# Altium schematic sheet FMC_Test_Module.SchDoc: FMC Test Module
size A3; Author: mayerph; DrawnBy: mayerph; Organization: IIS; Revision: PA; SheetNumber: 3; SheetTotal: 3
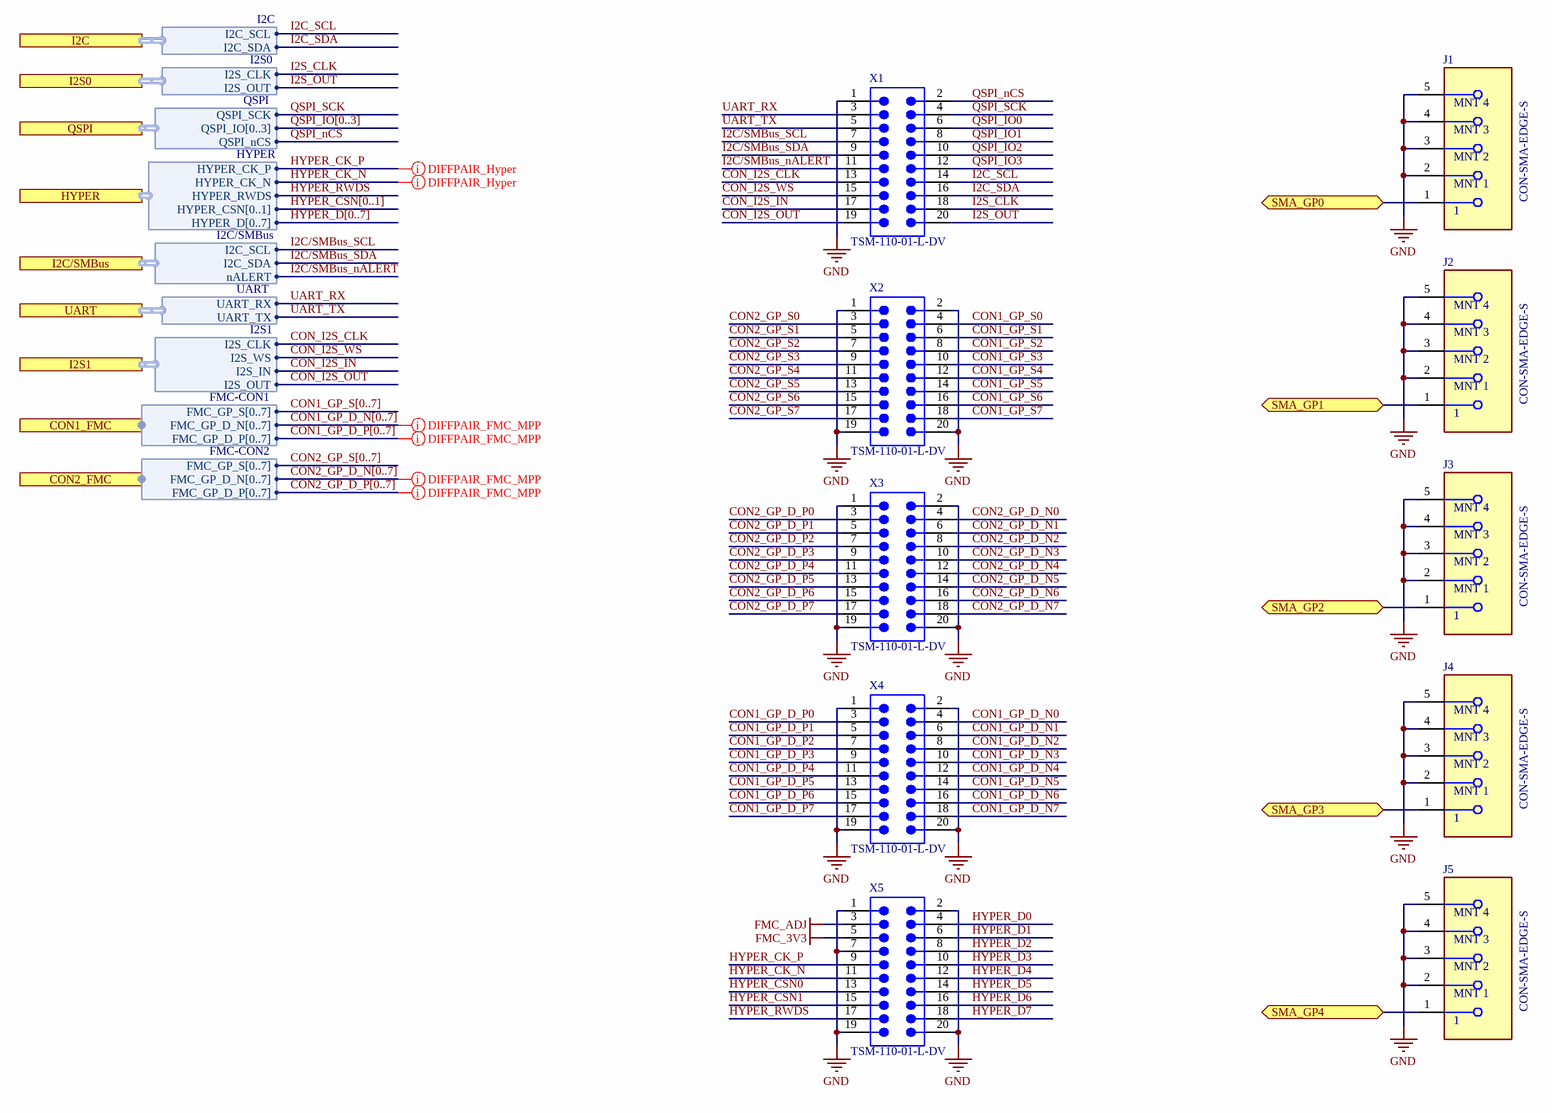
[diagram p0: FMC_Test_Module.SchDoc]

## Parts
J1  CON-SMA-EDGE-S  [FP-CON-SMA-EDGE-S-MFG]
J2  CON-SMA-EDGE-S  [FP-CON-SMA-EDGE-S-MFG]
J3  CON-SMA-EDGE-S  [FP-CON-SMA-EDGE-S-MFG]
J4  CON-SMA-EDGE-S  [FP-CON-SMA-EDGE-S-MFG]
J5  CON-SMA-EDGE-S  [FP-CON-SMA-EDGE-S-MFG]
X1  TSM-110-01-L-DV  [SMTC-TSM-110-01-X-DV]
X2  TSM-110-01-L-DV  [SMTC-TSM-110-01-X-DV]
X3  TSM-110-01-L-DV  [SMTC-TSM-110-01-X-DV]
X4  TSM-110-01-L-DV  [SMTC-TSM-110-01-X-DV]
X5  TSM-110-01-L-DV  [SMTC-TSM-110-01-X-DV]

## Ports
CON1_FMC (harness FMC-CON1), CON2_FMC (harness FMC-CON2), HYPER (harness HYPER), I2C (harness I2C), I2C/SMBus (harness I2C/SMBus), I2S0 (harness I2S0), I2S1 (harness I2S1), QSPI (harness QSPI), SMA_GP0 (bidir), SMA_GP1 (bidir), SMA_GP2 (bidir), SMA_GP3 (bidir), SMA_GP4 (bidir), UART (harness UART)

## Harnesses
I2C/SMBus: I2C_SDA, I2C_SCL, nALERT
UART: UART_TX, UART_RX
I2S1: I2S_OUT, I2S_IN, I2S_WS, I2S_CLK
FMC-CON1: FMC_GP_D_N[0..7], FMC_GP_S[0..7], FMC_GP_D_P[0..7]
I2S0: I2S_OUT, I2S_CLK
I2C: I2C_SDA, I2C_SCL
QSPI: QSPI_SCK, QSPI_IO[0..3], QSPI_nCS
HYPER: HYPER_CK_N, HYPER_CK_P, HYPER_RWDS, HYPER_CSN[0..1], HYPER_D[0..7]
FMC-CON2: FMC_GP_D_N[0..7], FMC_GP_S[0..7], FMC_GP_D_P[0..7]

## Nets
FMC_3V3: X5.5
FMC_ADJ: X5.3
GND: J1.2(MNT_1) J1.3(MNT_2) J1.4(MNT_3) J1.5(MNT_4) J2.2(MNT_1) J2.3(MNT_2) J2.4(MNT_3) J2.5(MNT_4) J3.2(MNT_1) J3.3(MNT_2) J3.4(MNT_3) J3.5(MNT_4) J4.2(MNT_1) J4.3(MNT_2) J4.4(MNT_3) J4.5(MNT_4) J5.2(MNT_1) J5.3(MNT_2) J5.4(MNT_3) J5.5(MNT_4) X1.1 X2.1 X2.2 X2.19 X2.20 X3.1 X3.2 X3.19 X3.20 X4.1 X4.2 X4.19 X4.20 X5.1 X5.2 X5.7 X5.19 X5.20
CON1_GP_D_N0: X4.4
CON1_GP_D_N1: X4.6
CON1_GP_D_N2: X4.8
CON1_GP_D_N3: X4.10
CON1_GP_D_N4: X4.12
CON1_GP_D_N5: X4.14
CON1_GP_D_N6: X4.16
CON1_GP_D_N7: X4.18
CON1_GP_D_P0: X4.3
CON1_GP_D_P1: X4.5
CON1_GP_D_P2: X4.7
CON1_GP_D_P3: X4.9
CON1_GP_D_P4: X4.11
CON1_GP_D_P5: X4.13
CON1_GP_D_P6: X4.15
CON1_GP_D_P7: X4.17
CON1_GP_S0: X2.4
CON1_GP_S1: X2.6
CON1_GP_S2: X2.8
CON1_GP_S3: X2.10
CON1_GP_S4: X2.12
CON1_GP_S5: X2.14
CON1_GP_S6: X2.16
CON1_GP_S7: X2.18
CON2_GP_D_N0: X3.4
CON2_GP_D_N1: X3.6
CON2_GP_D_N2: X3.8
CON2_GP_D_N3: X3.10
CON2_GP_D_N4: X3.12
CON2_GP_D_N5: X3.14
CON2_GP_D_N6: X3.16
CON2_GP_D_N7: X3.18
CON2_GP_D_P0: X3.3
CON2_GP_D_P1: X3.5
CON2_GP_D_P2: X3.7
CON2_GP_D_P3: X3.9
CON2_GP_D_P4: X3.11
CON2_GP_D_P5: X3.13
CON2_GP_D_P6: X3.15
CON2_GP_D_P7: X3.17
CON2_GP_S0: X2.3
CON2_GP_S1: X2.5
CON2_GP_S2: X2.7
CON2_GP_S3: X2.9
CON2_GP_S4: X2.11
CON2_GP_S5: X2.13
CON2_GP_S6: X2.15
CON2_GP_S7: X2.17
CON_I2S_CLK: X1.13 ; port I2S1.I2S_CLK
CON_I2S_IN: X1.17 ; port I2S1.I2S_IN
CON_I2S_OUT: X1.19 ; port I2S1.I2S_OUT
CON_I2S_WS: X1.15 ; port I2S1.I2S_WS
HYPER_CK_N: X5.11 ; port HYPER.HYPER_CK_N
HYPER_CK_P: X5.9 ; port HYPER.HYPER_CK_P
HYPER_CSN0: X5.13
HYPER_CSN1: X5.15
HYPER_D0: X5.4
HYPER_D1: X5.6
HYPER_D2: X5.8
HYPER_D3: X5.10
HYPER_D4: X5.12
HYPER_D5: X5.14
HYPER_D6: X5.16
HYPER_D7: X5.18
HYPER_RWDS: X5.17 ; port HYPER.HYPER_RWDS
I2C/SMBus_nALERT: X1.11 ; port I2C/SMBus.nALERT
I2C/SMBus_SCL: X1.7 ; port I2C/SMBus.I2C_SCL
I2C/SMBus_SDA: X1.9 ; port I2C/SMBus.I2C_SDA
I2C_SCL: X1.14 ; port I2C.I2C_SCL
I2C_SDA: X1.16 ; port I2C.I2C_SDA
I2S_CLK: X1.18 ; port I2S0.I2S_CLK
I2S_OUT: X1.20 ; port I2S0.I2S_OUT
QSPI_IO0: X1.6
QSPI_IO1: X1.8
QSPI_IO2: X1.10
QSPI_IO3: X1.12
QSPI_nCS: X1.2 ; port QSPI.QSPI_nCS
QSPI_SCK: X1.4 ; port QSPI.QSPI_SCK
SMA_GP0: J1.1 ; port SMA_GP0
SMA_GP1: J2.1 ; port SMA_GP1
SMA_GP2: J3.1 ; port SMA_GP2
SMA_GP3: J4.1 ; port SMA_GP3
SMA_GP4: J5.1 ; port SMA_GP4
UART_RX: X1.3 ; port UART.UART_RX
UART_TX: X1.5 ; port UART.UART_TX

## Buses and harness runs
bus CON1_GP_D_N[0..7]
bus CON1_GP_D_P[0..7]
bus CON1_GP_S[0..7]
bus CON2_GP_D_N[0..7]
bus CON2_GP_D_P[0..7]
bus CON2_GP_S[0..7]
bus HYPER_CSN[0..1]
bus HYPER_D[0..7]
bus QSPI_IO[0..3]

## Layout directives
differential pair; net class DIFFPAIR_Hyper: HYPER_CK_N, HYPER_CK_P
differential pair; net class DP_FMC_MPP_CON1: (no net found under the mark)
differential pair; net class DP_FMC_MPP_CON2: (no net found under the mark)

## Notes on the sheet
- 1
- 2
- 3
- 4
- 5
- 6
- 7
- 8
- A
- B
- C
- D
- Project:
- Date:
- Drawing number:
- Rev:
- Format:
- A3
- Drawn by:
- Laboratory:
- Page
- Sheet:
- of
- File:

## Library data of the parts
J1-J5 = CMP-204357-000001-1: CONN SMA JACK STR EDGE MNT; Manufacturer: RF Solutions Ltd.; Impedance: 50Ω; Conn Orientation: Right Angle; Is Female: yes; Number Of Contacts: 1; Frequency: 18GHz; Shielding: true; Category: Conn; ComponentLink2URL: https://www.rfsolutions.co.uk/downloads/1498648656DS-CON-EDGE-SMA-4.pdf; Octopart: https://octopart.com/con-sma-edge-s-rf+solutions-70967450; Package: CONN_JACK; Manufacturer Part Number: CON-SMA-EDGE-S; Height: 6.35mm; Device Class L1: Connectors; Footprint Url: https://forum.upverter.com/uploads/default/original/3X/b/e/be75b907af57498775929d6d9099689c472e0307.pdf; Contact Material: Gold; ComponentLink2Description: Datasheet; Device Class L2: RF / Coaxial Connectors; RoHS: TRUE; Device Class L3: unset; Digikey Description: CONN SMA JACK STR EDGE MNT; Lead Free: Yes; Automotive: No
X1-X5 = CMP-1024-00285-1: 0.025" SQ Post Header, Surface Mount, Vertical, -55 to 125 degC, 2.54 mm Pitch, 20-Pin, Male, RoHS; Manufacturer: Samtec; Pitch: 2.54 mm; Number of Positions: 20; Connector Type: Male Pin; Current Rating: 7A; Voltage Rating: 475V; Row Spacing: 0.1inch; PackageReference: TSM-110-01-X-DV; PackageDescription: Double Row Gullwing ASM; ComponentLink3Description: Package Specification; ComponentLink3URL: http://www.samtec.com/documents/webfiles/cpdf/TSM-1XX-XX-XXX-XX-X-XXX-X-MKT.pdf; DatasheetVersion: F-214; ComponentLink2Description: Datasheet; PartNumber: TSM-110-01-L-DV; Temperature Range: -55 to 125 degC; Orientation: Vertical; ComponentLink1URL: http://www.samtec.com; Mounting Technology: Surface Mount; ComponentLink1Description: Manufacturer URL; ComponentLink2URL: http://www.samtec.com/documents/webfiles/pdf/TSM.PDF; RoHS: True; PackageVersion: DJ, 4/1991; Supplier 1: Digi-Key; Supplier Part Number 1: SAM10819-ND; Manufacturer Part Number: TSM-110-01-L-DV; Category: Headers and Wire Housings; Stock 1: 159; Pricing 1: 1=2.18000, 10=1.97700, 100=1.69470, 500=1.41226, 1000=1.21050, 5000=1.07331, 10000=1.04910 (USD); Contact Plating: Gold; Contact Material: Bronze; Housing Material: Polymer; Color: Black; Housing Color: Black; Min Operating Temperature: -55°C; Max Operating Temperature: 125°C; Termination: Solder; Number of Rows: 2; Packaging: Bulk; Number of Contacts: 20; Gender: Male; Package Quantity: 1; Max Current Rating: 7A; Max Voltage Rating (AC): 475V; Length: 25.4mm; Depth: 5.08mm; Contact Mating Length: 0.23inch; Radiation Hardening: No; REACH SVHC: No SVHC; Lead Free: Lead Free; ComponentLink4URL: https://datasheet.ciiva.com/25616/0900766b81157e6c-25616960.pdf?src-supplier=RSComponents; ComponentLink4Description: https://datasheet.ciiva.com/25616/0900766b81157e6c-25616960.pdf?src-supplier=RSComponents; ComponentLink5URL: https://datasheet.ciiva.com/22677/1847330-22677900.pdf?src-supplier=Element14; ComponentLink5Description: https://datasheet.ciiva.com/22677/1847330-22677900.pdf?src-supplier=Element14; ComponentLink6URL: https://datasheet.ciiva.com/737/tsm-1xx-xx-xxx-xx-x-xxx-x-mkt-737871.pdf?src-supplier=Digi-Key; ComponentLink6Description: https://datasheet.ciiva.com/737/tsm-1xx-xx-xxx-xx-x-xxx-x-mkt-737871.pdf?src-supplier=Digi-Key